# EAGLE design avalanch_pulse_gen (EAGLE 9.1.2)
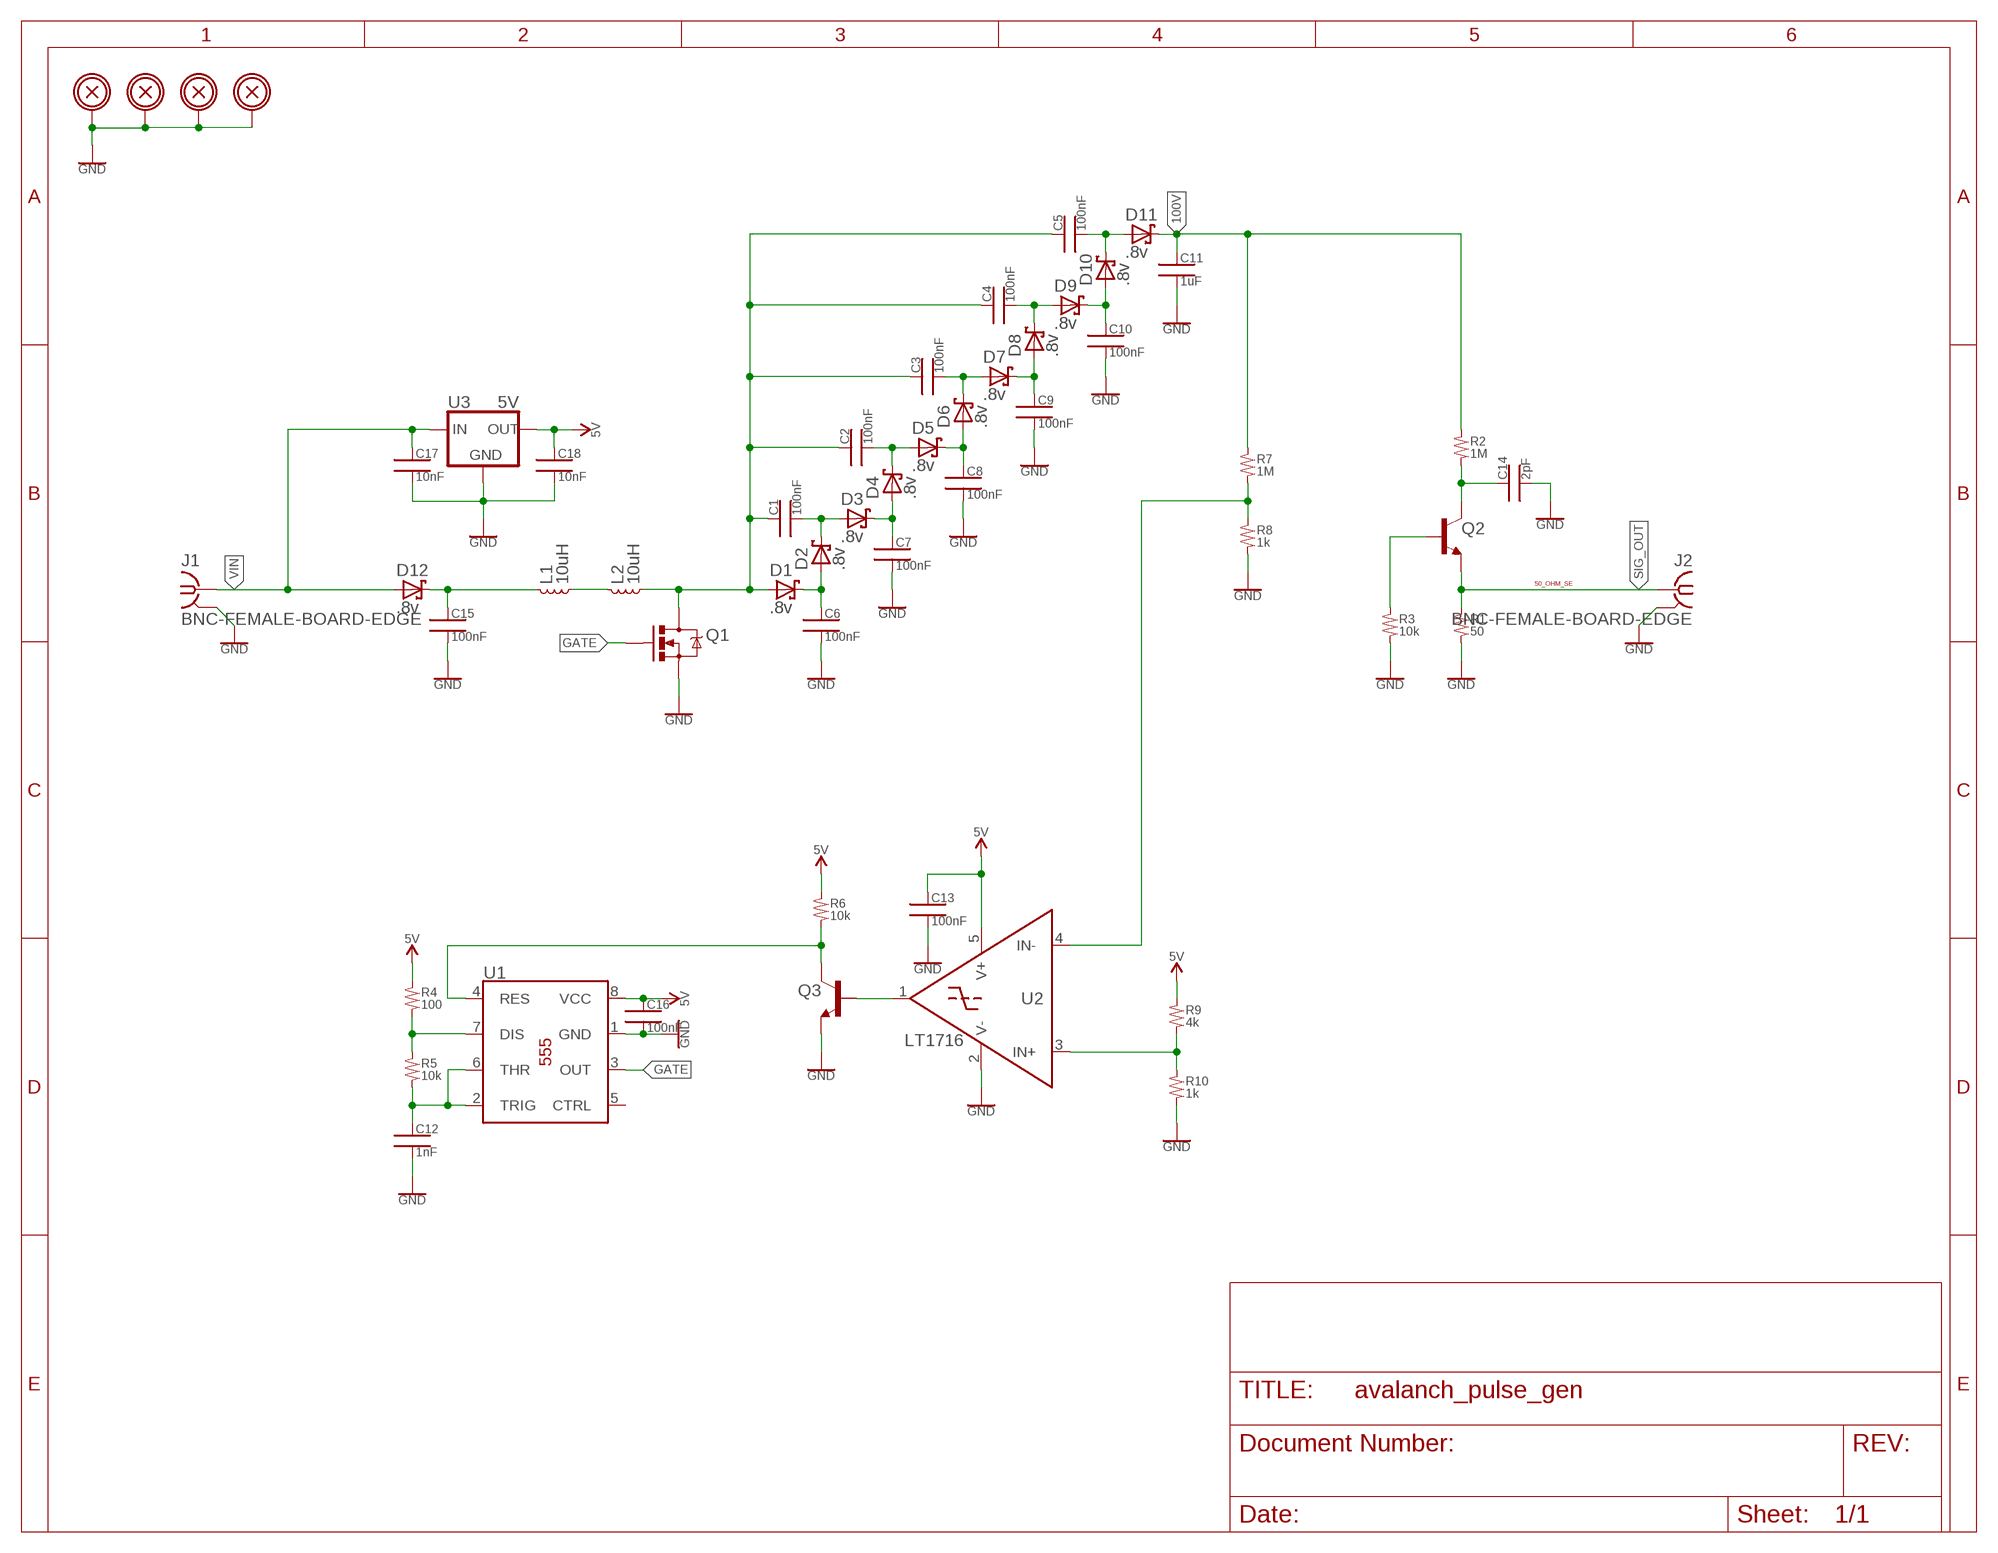
[diagram p0: schematic, sheet 1]

## Parts
C1  100nF  CAP_SMD_1206  [1206]
C2  100nF  CAP_SMD_1206  [1206]
C3  100nF  CAP_SMD_1206  [1206]
C4  100nF  CAP_SMD_1206  [1206]
C5  100nF  CAP_SMD_1206  [1206]
C6  100nF  CAP_SMD_1206  [1206]
C7  100nF  CAP_SMD_1206  [1206]
C8  100nF  CAP_SMD_1206  [1206]
C9  100nF  CAP_SMD_1206  [1206]
C10  100nF  CAP_SMD_1206  [1206]
C11  1uF  CAP_SMD_2220  [2220]
C12  1nF  CAP_SMD_0402  [0402]
C13  100nF  CAP_SMD_0402  [0402]
C14  2pF  CAP_SMD_0805  [0805]
C15  100nF  CAP_SMD_1206  [1206]
C16  100nF  CAP_SMD_0402  [0402]
C17  10nF  CAP_SMD_0402  [0402]
C18  10nF  CAP_SMD_0402  [0402]
D1  .8v  SCHOTTKY_SOD-123  [SOD-123]
D2  .8v  SCHOTTKY_SOD-123  [SOD-123]
D3  .8v  SCHOTTKY_SOD-123  [SOD-123]
D4  .8v  SCHOTTKY_SOD-123  [SOD-123]
D5  .8v  SCHOTTKY_SOD-123  [SOD-123]
D6  .8v  SCHOTTKY_SOD-123  [SOD-123]
D7  .8v  SCHOTTKY_SOD-123  [SOD-123]
D8  .8v  SCHOTTKY_SOD-123  [SOD-123]
D9  .8v  SCHOTTKY_SOD-123  [SOD-123]
D10  .8v  SCHOTTKY_SOD-123  [SOD-123]
D11  .8v  SCHOTTKY_SOD-123  [SOD-123]
D12  .8v  SCHOTTKY_SOD-123  [SOD-123]
H1  BOLTHOLE_M2.5  [M2.5_HOLE]
H2  BOLTHOLE_M2.5  [M2.5_HOLE]
H3  BOLTHOLE_M2.5  [M2.5_HOLE]
H4  BOLTHOLE_M2.5  [M2.5_HOLE]
J1  BNC-FEMALE-BOARD-EDGE  [AMPHENOL_112640]
J2  BNC-FEMALE-BOARD-EDGE  [AMPHENOL_112640]
L1  10uH  IND_SMD_WE74405031100  [WE74405031100]
L2  10uH  IND_SMD_WE74405031100  [WE74405031100]
Q1  MOSFET_N-CHANNEL_SOT23-3  [SOT23-3]
Q2  BJT_NPN  [SOT23-3]
Q3  BJT_NPN  [SOT23-3]
R1  50  RES_SMD_0402  [0402]
R2  1M  RES_SMD_1206  [1206]
R3  10k  RES_SMD_0402  [0402]
R4  100  RES_SMD_0402  [0402]
R5  10k  RES_SMD_0402  [0402]
R6  10k  RES_SMD_0402  [0402]
R7  1M  RES_SMD_1206  [1206]
R8  1k  RES_SMD_0402  [0402]
R9  4k  RES_SMD_0402  [0402]
R10  1k  RES_SMD_0402  [0402]
U1  555_TIMER_SOIC-8  [SOIC_8]
U2  LT1716  [SOT23-5]
U3  5V  UAMXX-Q1DCY  [SOT233-4]

## Nets
5V: C13.1 C16.1 C18.1 R4.1 R6.1 R9.1 U1.8(VCC) U2.5(V+) U3.3(OUT)
100V [HV]: C11.1 D11.1C(C) R2.1 R7.1
GATE: Q1.1(G) U1.3(OUT)
GND: C6.2 C7.2 C8.2 C9.2 C10.2 C11.2 C12.2 C13.2 C14.2 C15.2 C16.2 C17.2 C18.2 H1.P H2.P H3.P H4.P J1.SH1(GND) J1.SH2(GND) J1.SH3(GND) J1.SH4(GND) J2.SH1(GND) J2.SH2(GND) J2.SH3(GND) J2.SH4(GND) Q1.2(S) Q3.2(E) R1.2 R3.2 R8.2 R10.2 U1.1(GND) U2.2(V-) U3.2(GND) U3.4(GND)
N$1 [HV]: C6.1 D1.1C(C) D2.2A(A)
N$2 [HV]: C1.2 D2.1C(C) D3.2A(A)
N$3 [HV]: C2.2 D4.1C(C) D5.2A(A)
N$4 [HV]: C7.1 D3.1C(C) D4.2A(A)
N$5 [HV]: C8.1 D5.1C(C) D6.2A(A)
N$6 [HV]: C1.1 C2.1 C3.1 C4.1 C5.1 D1.2A(A) L2.2 Q1.3(D)
N$7 [HV]: C3.2 D6.1C(C) D7.2A(A)
N$8 [HV]: C9.1 D7.1C(C) D8.2A(A)
N$9 [HV]: C4.2 D8.1C(C) D9.2A(A)
N$10 [HV]: C10.1 D9.1C(C) D10.2A(A)
N$11 [HV]: C5.2 D10.1C(C) D11.2A(A)
N$12: C12.1 R5.2 U1.2(TRIG) U1.6(THR)
N$13: Q2.1(B) R3.1
N$14 [HV]: C14.1 Q2.3(C) R2.2
N$15: R4.2 R5.1 U1.7(DIS)
N$16: Q3.3(C) R6.2 U1.4(RES)
N$17: Q3.1(B) U2.1(OUT)
N$18: R7.2 R8.1 U2.4(IN-)
N$19: R9.2 R10.1 U2.3(IN+)
N$20: C15.1 D12.1C(C) L1.1
N$21 [HV]: L1.2 L2.1
SIG_OUT [50_OHM_SE]: J2.SIG Q2.2(E) R1.1
VIN: C17.1 D12.2A(A) J1.SIG U3.1(IN)
Unconnected: U1.5(CTRL)

## Notes on the sheet
- 50_OHM_SE

## Library data of the parts
C1-C18 = jack_RCL:CAP_SMD
D1-D12 = jack_semi:SCHOTTKY
H1-H4 = jack_mechanical:BOLTHOLE
J1 J2 = jack_connector:BNC
L1 L2 = jack_RCL:IND_SMD
Q1 = jack_semi:MOSFET_N-CHANNEL
Q2 Q3 = jack_semi:BJT_NPN
R1-R10 = jack_RCL:RES_SMD
U1 = jack_IC:555_TIMER: SE555
U2 = jack_IC:LT1716: SOT-23, 44V, Over-the-Top, Micropower, Precision Rail-to-Rail Comparator http://www.analog.com/media/en/technical-documentation/data-sheets/1716fa.pdf
U3 = jack_IC:UAMXX-Q1: uA78Mxx-Q1 SERIES POSITIVE-VOLTAGE REGULATORS http://www.ti.com/lit/ds/symlink/ua78m-q1.pdf

## Net classes
1 50_OHM_SE: clearance 0.3 mm
2 HV: clearance 0.9 mm

## Board
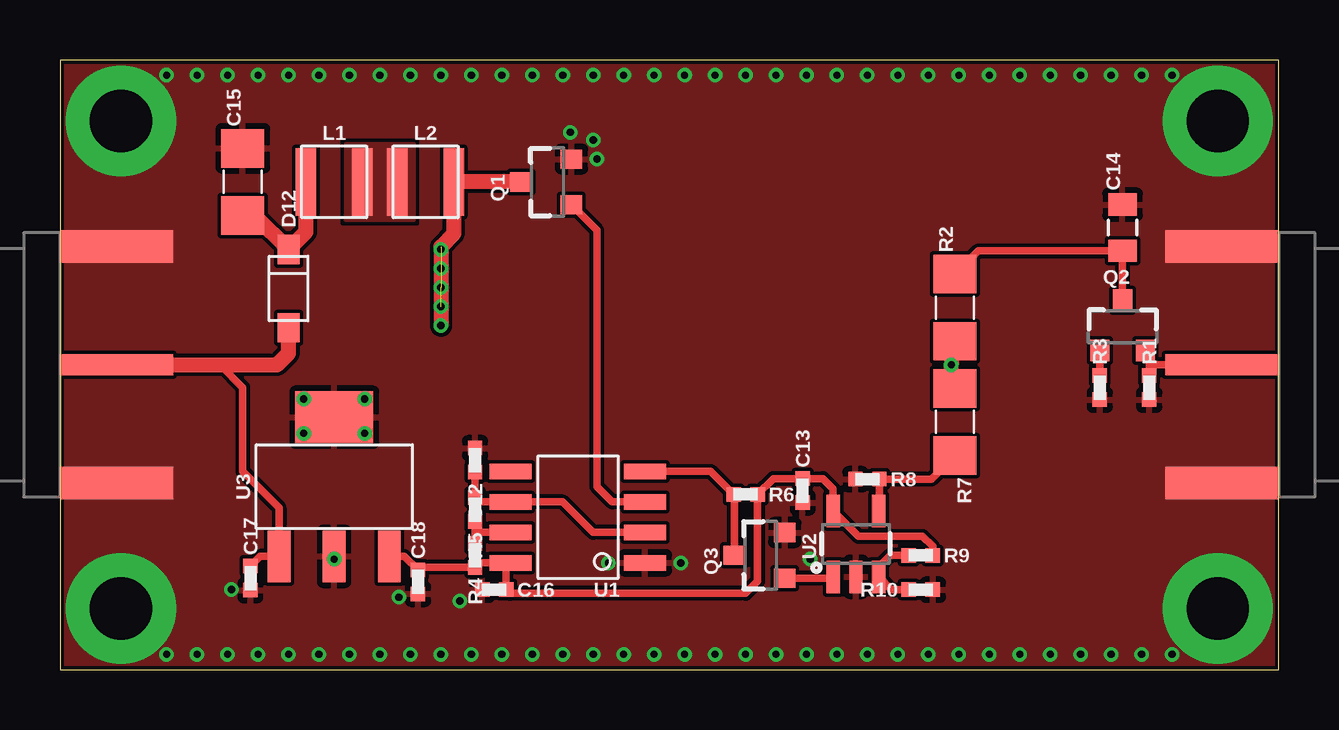
[diagram p1: board, top side]
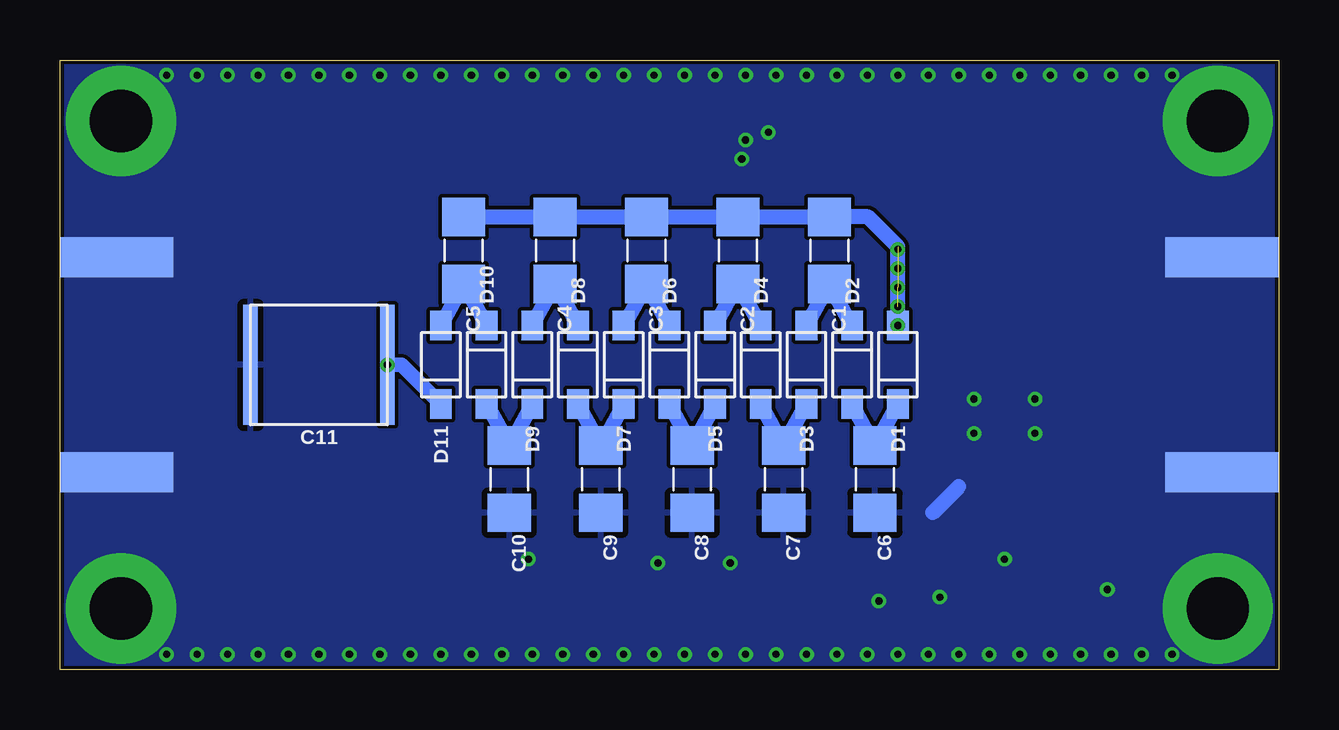
[diagram p2: board, bottom side, seen from below]

Size 50.8 x 25.4 mm. Coordinates in mm from the lower left corner, seen from the top.
Outline: 0,0 50.8,0 50.8,25.4 0,25.4 0,0
Copper layers (1*16): Top 0.035mm / dielectric 1.5mm / Bottom 0.035mm
Design rules "3PCB_2layer": minimum track width 6mil, minimum drill 0.3mm, track to track 6mil, track to pad 6mil, pad to pad 6mil, via to via 6mil, smd to smd 0mil, copper to edge 6mil, drill to drill 6mil, minimum pad ring 6mil, minimum via ring 6mil, stop-mask expansion 2mil, vias tented up to drill 0.3mm, thermal gap 10mil

### Footprints (pad centres in the part's own frame; a part is rotated, then mirrored left to right if it is on the bottom)
1206 = smd 1.6 x 1.8: 1 -1.4,0; 2 1.4,0
2220 = smd 0.6 x 5: 1 -2.85,0; 2 2.85,0
0402 = smd 0.6 x 0.6: 1 -0.5,0; 2 0.5,0
0805 = smd 0.927 x 1.2: 1 -0.964,0; 2 0.964,0
SOD-123 = smd 1.22 x 0.91: 1C 1.635,0; 2A -1.635,0
M2.5_HOLE = drill 2.6 pad 4.6: P 0,0
AMPHENOL_112640 = smd 4.72 x 1.35: SH1 2.36,4.925; SH2 2.36,-4.925 | smd 4.72 x 1.67 bottom: SH3 2.36,4.475; SH4 2.36,-4.475 | smd 4.72 x 0.86: SIG 2.36,0
WE74405031100 = smd 0.85 x 2.8: 1 -1.175,0; 2 1.175,0
SOT23-3 = smd 0.8 x 0.9: 1 -0.95,-1; 2 0.95,-1; 3 0,1.1
SOIC_8 = smd 1.75 x 0.65: 1 -2.8,1.905; 2 -2.8,0.635; 3 -2.8,-0.635; 4 -2.8,-1.905; 5 2.8,-1.905; 6 2.8,-0.635; 7 2.8,0.635; 8 2.8,1.905
SOT23-5 = smd 0.55 x 1.35: 1 -0.95,-1.375; 2 0,-1.375; 3 0.95,-1.375; 4 0.95,1.375; 5 -0.95,1.375
SOT233-4 = smd 0.95 x 2.15: 1 -2.3,-2.9; 2 0,-2.9; 3 2.3,-2.9 | smd 3.25 x 2.15: 4 0,2.9

### Placement (x,y rotation side)
C1  18.73,17.46 270 bottom
C2  22.54,17.46 270 bottom
C3  26.35,17.46 270 bottom
C4  30.16,17.46 270 bottom
C5  33.97,17.46 270 bottom
C6  16.83,7.94 270 bottom
C7  20.64,7.94 270 bottom
C8  24.45,7.94 270 bottom
C9  28.26,7.94 270 bottom
C10  32.07,7.94 270 bottom
C11  40.01,12.7 180 bottom
C12  17.3,8.73 90 top
C13  30.96,7.46 270 top
C14  44.29,18.41 90 top
C15  7.62,20.32 90 top
C16  18.1,3.33 180 top
C17  7.94,3.81 270 top
C18  14.92,3.65 270 top
D1  15.88,12.7 270 bottom
D2  17.78,12.7 90 bottom
D3  19.68,12.7 270 bottom
D4  21.59,12.7 90 bottom
D5  23.5,12.7 270 bottom
D6  25.4,12.7 90 bottom
D7  27.3,12.7 270 bottom
D8  29.21,12.7 90 bottom
D9  31.11,12.7 270 bottom
D10  33.02,12.7 90 bottom
D11  34.92,12.7 270 bottom
D12  9.53,15.88 90 top
H1  2.54,2.54 0 top
H2  2.54,22.86 0 top
H3  48.26,22.86 0 top
H4  48.26,2.54 0 top
J1  0,12.7 0 top
J2  50.8,12.7 180 top
L1  11.43,20.32 0 top
L2  15.24,20.32 0 top
Q1  20.32,20.32 90 top
Q2  44.29,14.29 0 top
Q3  29.21,4.76 90 top
R1  45.4,11.75 270 top
R2  37.31,15.08 90 top
R3  43.34,11.75 270 top
R4  17.3,4.76 90 top
R5  17.3,6.67 90 top
R6  28.57,7.3 180 top
R7  37.31,10.32 270 top
R8  33.66,7.94 180 top
R9  35.88,4.76 180 top
R10  35.88,3.33 0 top
U1  21.59,6.35 180 top
U2  33.18,5.24 0 top
U3  11.43,7.62 0 top

### Tracks (layer width: path | path; a pad name or v marks a point on that pad's centre or on a via)
5V
  Top 0.318: R9.1 36.38,5.14 35.96,5.56 33.29,5.56 U2.5 32.23,7.54 31.81,7.96 C13.1 29.73,7.96 R6.1 29.07,3.67 28.57,3.17 18.76,3.17 C16.1 18.6,4.25 U1.8 17.49,4.45 R4.1 15.03,4.26 C18.1 14.35,4.72 U3.3
100V  (via drill 0.3)
  Top 0.635: R7.1 37.16,11.87 C11.1 37.16,13.53 R2.1
  Bottom 0.6: D11.1C 36.56,12.7 C11.1
  other vias: 37.16,12.7
GATE
  Top 0.318: U1.3 23.02,6.99 22.38,7.62 22.38,18.31 Q1.1
GND  (via drill 0.3)
  Bottom 0.635: 14.42,6.54 13.34,7.62
  other vias: 5.71,24.77 6.99,24.77 8.26,24.77 9.53,24.77 10.79,24.77 12.06,24.77 13.34,24.77 14.61,24.77 4.45,24.77 46.35,24.77 15.88,24.77 17.14,24.77 18.41,24.77 19.68,24.77 20.95,24.77 22.23,24.77 23.5,24.77 24.77,24.77 26.04,24.77 27.3,24.77 28.57,24.77 29.84,24.77 31.11,24.77 32.38,24.77 33.66,24.77 34.92,24.77 36.2,24.77 37.47,24.77 38.73,24.77 40.01,24.77 41.27,24.77 42.55,24.77 43.81,24.77 45.09,24.77 5.71,0.64 6.99,0.64 8.26,0.64 9.53,0.64 10.79,0.64 12.06,0.64 13.34,0.64 14.61,0.64 4.45,0.64 46.35,0.64 15.88,0.64 17.14,0.64 18.41,0.64 19.68,0.64 20.95,0.64 22.23,0.64 23.5,0.64 24.77,0.64 26.04,0.64 27.3,0.64 28.57,0.64 29.84,0.64 31.11,0.64 32.38,0.64 33.66,0.64 34.92,0.64 36.2,0.64 37.47,0.64 38.73,0.64 40.01,0.64 41.27,0.64 42.55,0.64 43.81,0.64 45.09,0.64 25.88,4.45 22.86,4.45 31.27,4.6 16.67,2.86 10.16,11.27 12.7,11.27 12.7,9.84 10.16,9.84 11.43,4.6 7.14,3.33 14.13,3.02 22.38,21.27 21.27,22.38 22.23,22.07
  pour Top (rank 3): -2.54,27.94 53.34,27.94 53.34,-2.54 -2.54,-2.54
  pour Bottom: -3.81,29.21 54.61,29.21 54.61,-3.81 -3.81,-3.81
N$1
  Bottom 0.635: D1.1C C6.1 D2.2A
N$2
  Bottom 0.635: D2.1C C1.2 D3.2A
N$3
  Bottom 0.635: D5.2A C2.2 D4.1C
N$4
  Bottom 0.635: D3.1C C7.1 D4.2A
N$5
  Bottom 0.635: D6.2A C8.1 D5.1C
N$6  (via drill 0.3)  (4 unrouted)
  Top 0.635: v15.88,14.34 15.88,17.62 16.41,18.16 L2.2 Q1.3
  Bottom 0.635: C5.1 C4.1 C3.1 C2.1 C1.1 17.12,18.86 15.88,17.62 v15.88,14.34
  other vias: 15.88,15.13 15.88,15.92 15.88,16.72 15.88,17.51
N$7
  Bottom 0.635: D7.2A C3.2 D6.1C
N$8
  Bottom 0.635: D8.2A C9.1 D7.1C
N$9
  Bottom 0.635: D8.1C C4.2 D9.2A
N$10
  Bottom 0.635: D9.1C C10.1 D10.2A
N$11
  Bottom 0.635: D10.1C C5.2 D11.2A
N$12
  Top 0.318: U1.2 22.23,5.71 20.95,6.99 U1.6 17.49,6.99 R5.2 C12.1
N$13
  Top 0.318: R3.1 Q2.1
N$14
  Top 0.318: R2.2 38.28,17.45 C14.1 Q2.3
N$15
  Top 0.318: U1.7 17.3,5.71 | 17.3,5.71 R4.2 | R5.1 17.3,5.71
N$16
  Top 0.318: U1.4 27.12,8.26 R6.2 28.11,7.27 Q3.3
N$17
  Top 0.318: U2.1 32.18,3.81 Q3.1
N$18
  Top 0.318: R7.2 36.33,7.94 R8.1 34.16,6.64 U2.4
N$19
  Top 0.318: R10.1 34.66,3.33 U2.3 34.13,4.28 34.61,4.76 R9.2
N$20
  Top 0.635: L1.1 10.26,18.24 D12.1C 8.12,18.92 C15.1
N$21
  pour Top: 11.91,21.91 11.91,18.73 14.76,18.73 14.76,21.91
SIG_OUT
  Top 0.318: Q2.2 45.4,13.13 45.4,12.7 | 45.4,12.7 R1.1 | J2.SIG 45.4,12.7
VIN
  Top 0.318: C17.1 8.35,4.72 U3.1 9.13,6.75 7.62,8.26 7.62,11.75 6.67,12.7
  Top 0.635: J1.SIG 6.67,12.7 9.05,12.7 9.53,13.18 D12.2A